# EAGLE board Precision Arduino Charlieplex 1.1 (EAGLE 6.2), part 1 of 2
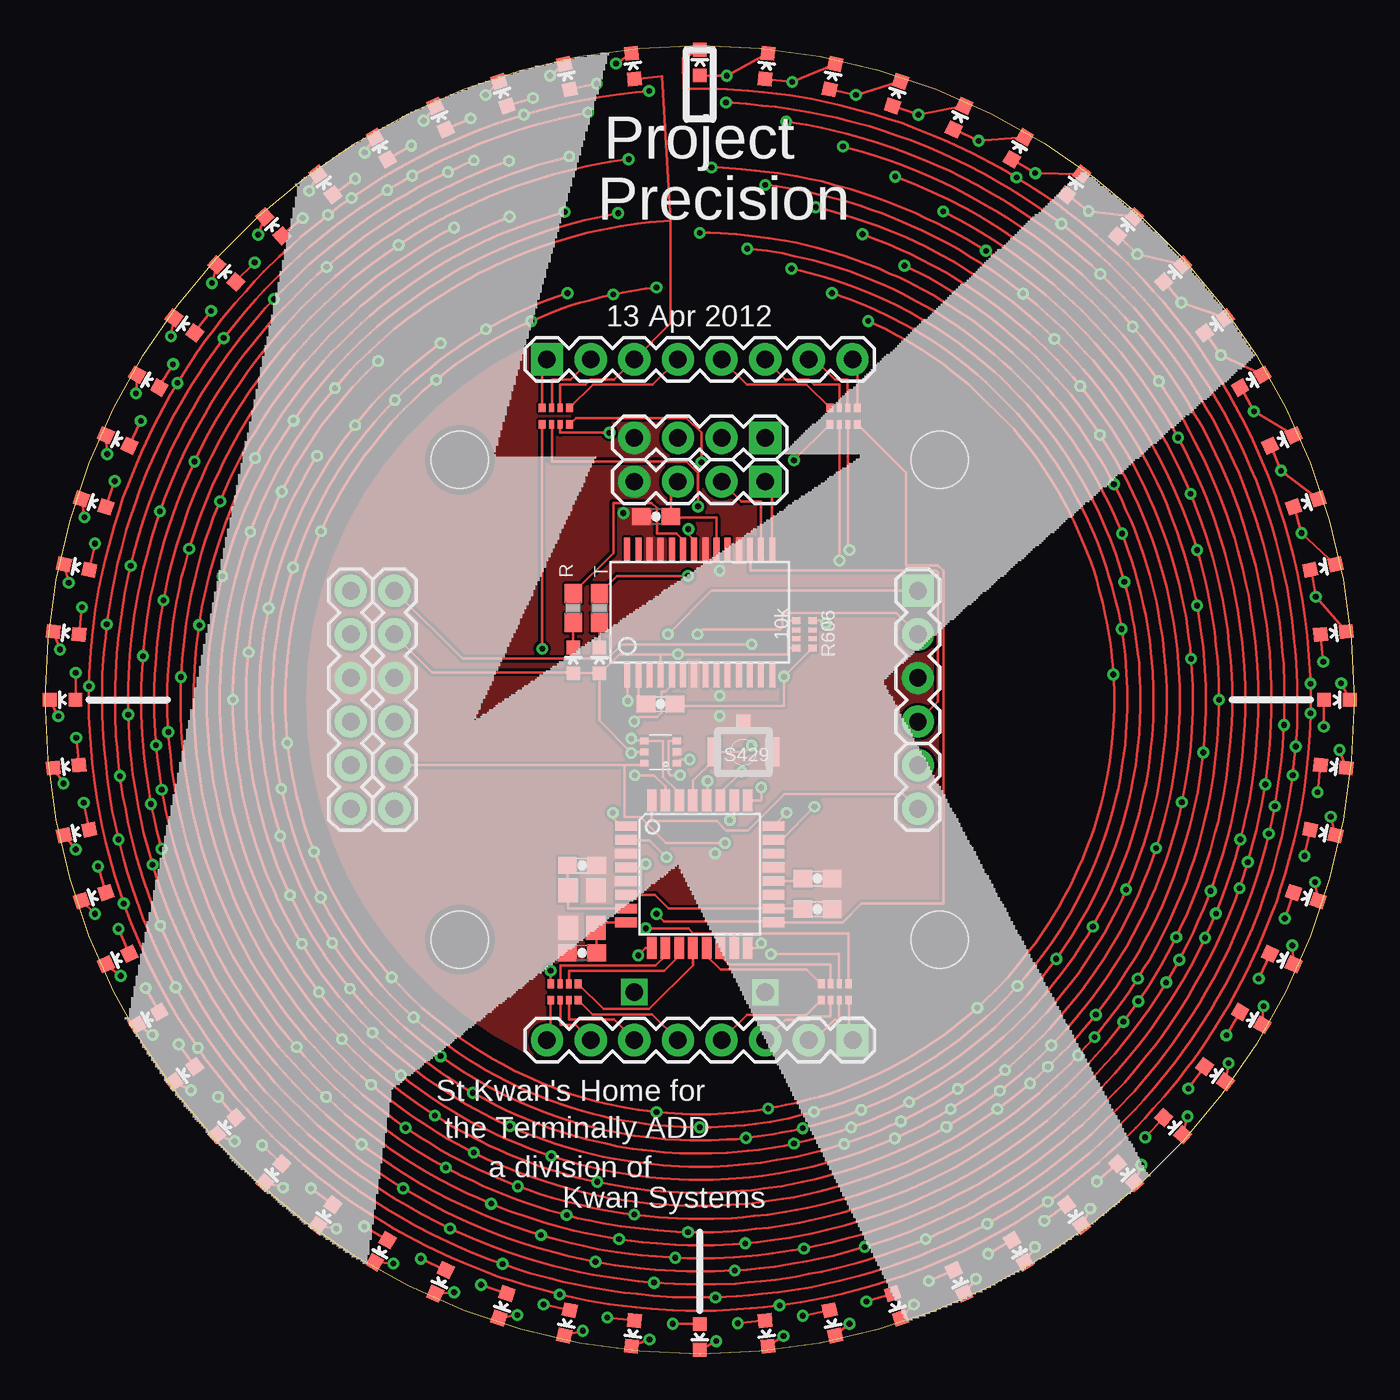
[diagram p2: board, top side]
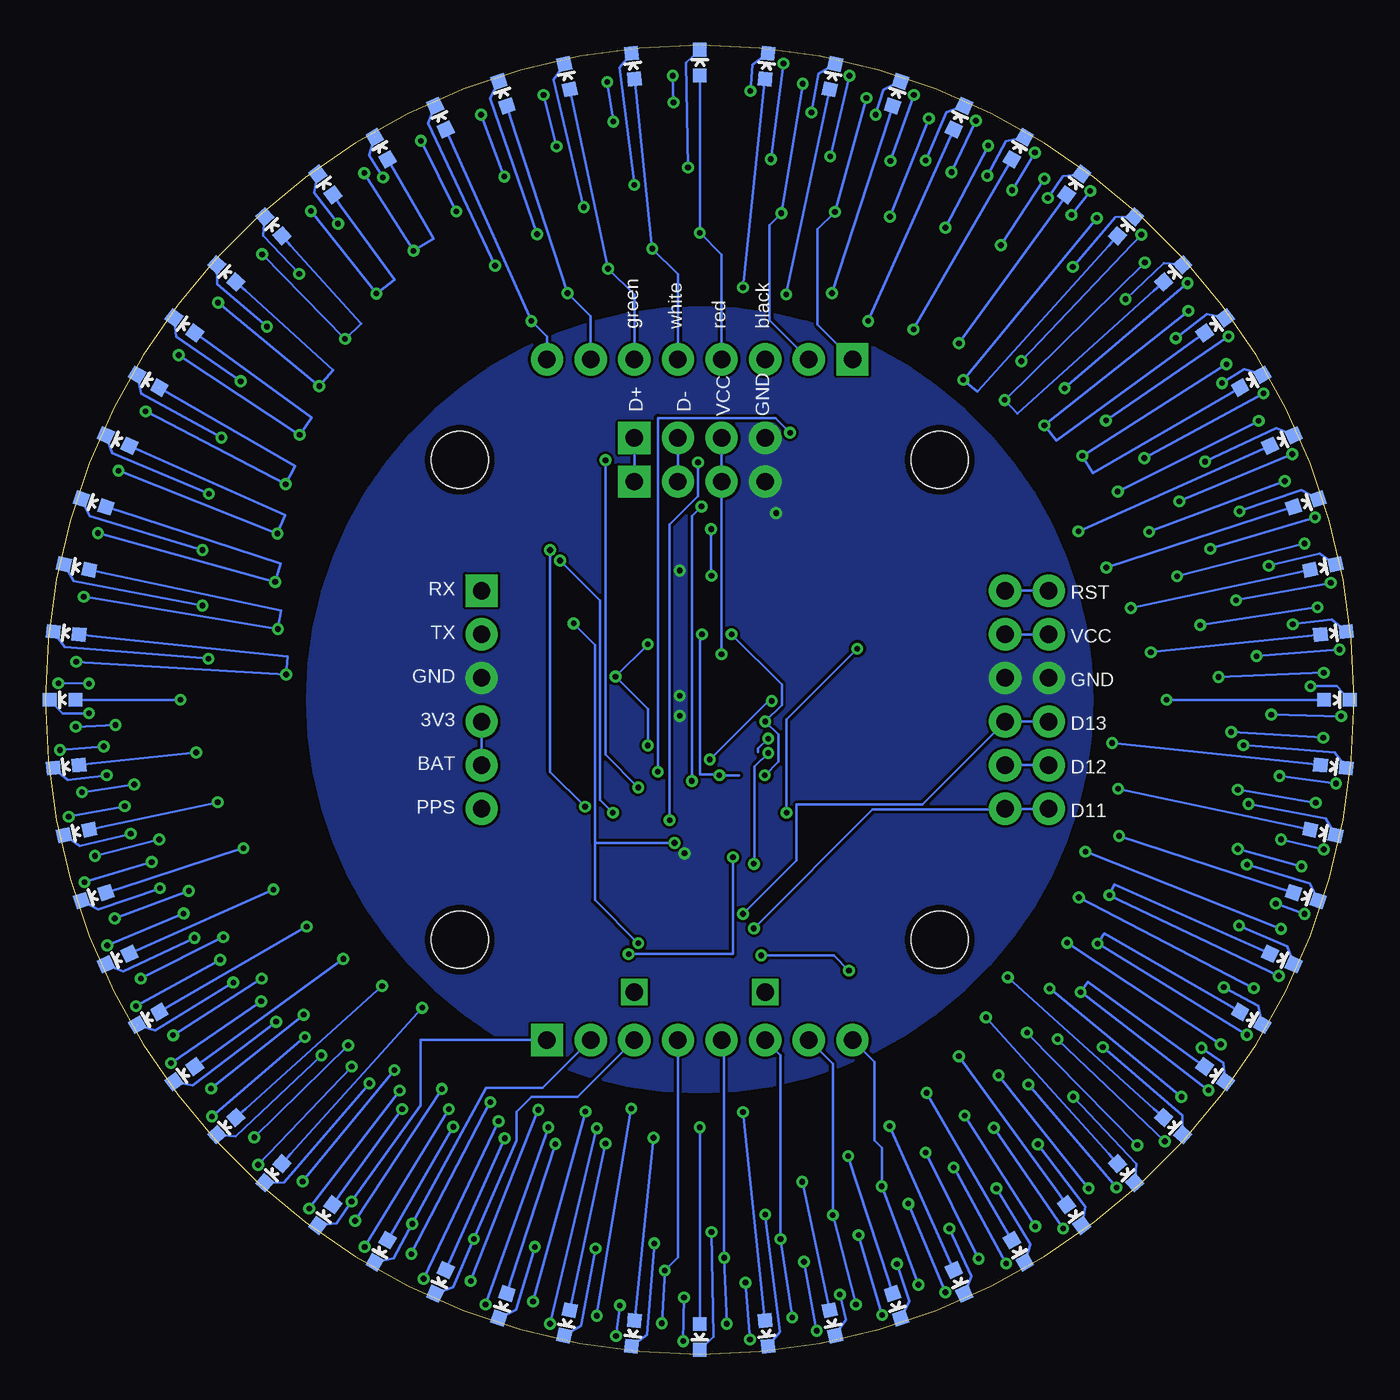
[diagram p3: board, bottom side, seen from below]

Size 76.2 x 76.2 mm. Coordinates in mm from the lower left corner, seen from the top.
Outline: 38.1,76.2 arc-90 76.2,38.1 arc-90 38.1,0 arc-90 0,38.1 arc-90 38.1,76.2
Copper layers (1*16): Top 0.0356mm / dielectric 1.5011mm / Bottom 0.0356mm
Design rules: minimum track width 6mil, minimum drill 13mil, track to track 6mil, track to pad 6mil, pad to pad 6mil, via to via 6mil, smd to smd 6mil, copper to edge 15mil, drill to drill 20mil, minimum pad ring 7mil, minimum via ring 7mil, stop-mask expansion 4mil, vias tented up to drill 14mil, thermal gap 10mil
Net classes: 0 default: width 0.152 mm, drill 0.33 mm, clearance 0.152 mm; 1 power: width 0.152 mm, drill 0.33 mm, clearance 0.152 mm

## Footprints (pad centres in the part's own frame; a part is rotated, then mirrored left to right if it is on the bottom)
0603-CAP = smd 1.1 x 1: 1 -0.85,0; 2 0.85,0
LED-0603 = smd 0.8 x 0.8: A 0,-0.75; C 0,0.75
1X04 = drill 1.016 pad 1.88 square: 1 0,0 | drill 1.016 pad 1.88: 2 2.54,0; 3 5.08,0; 4 7.62,0
1X06 = drill 1.016 pad 1.88: 1 0,0; 2 2.54,0; 3 5.08,0; 4 7.62,0; 5 10.16,0; 6 12.7,0
1X08 = drill 1.016 pad 1.88 square: 1 0,0 | drill 1.016 pad 1.88: 2 2.54,0; 3 5.08,0; 4 7.62,0; 5 10.16,0; 6 12.7,0; 7 15.24,0; 8 17.78,0
STAND-OFF = hole 3.302: 0,0
1X02 = drill 1.016 pad 1.88: 1 0,0; 2 2.54,0
CRA04 = smd 0.4 x 0.5: 1 -0.8,-0.475; 4 0.8,-0.475; 5 0.8,0.475; 8 -0.8,0.475 | smd 0.3 x 0.5: 2 -0.25,-0.475; 3 0.25,-0.475; 6 0.25,0.475; 7 -0.25,0.475
0603-RES = smd 1.1 x 1: 1 -0.85,0; 2 0.85,0
B3U-1100P = smd 0.8 x 1.7: P$1 -1.7,0; P$2 1.7,0 | smd 0.8 x 1.1: P$3 0,-1.65
TQFP32-08 = smd 1.27 x 0.559: 1 -4.293,2.8; 2 -4.293,2; 3 -4.293,1.2; 4 -4.293,0.4; 5 -4.293,-0.4; 6 -4.293,-1.2; 7 -4.293,-2; 8 -4.293,-2.8; 17 4.293,-2.8; 18 4.293,-2; 19 4.293,-1.2; 20 4.293,-0.4; 21 4.293,0.4; 22 4.293,1.2; 23 4.293,2; 24 4.293,2.8 | smd 0.559 x 1.27: 9 -2.8,-4.293; 10 -2,-4.293; 11 -1.2,-4.293; 12 -0.4,-4.293; 13 0.4,-4.293; 14 1.2,-4.293; 15 2,-4.293; 16 2.8,-4.293; 25 2.8,4.293; 26 2,4.293; 27 1.2,4.293; 28 0.4,4.293; 29 -0.4,4.293; 30 -1.2,4.293; 31 -2,4.293; 32 -2.8,4.293
SSOP28DB = smd 0.348 x 1.397: 1 -4.225,-3.656; 2 -3.575,-3.656; 3 -2.925,-3.656; 4 -2.275,-3.656; 5 -1.625,-3.656; 6 -0.975,-3.656; 7 -0.325,-3.656; 8 0.325,-3.656; 9 0.975,-3.656; 10 1.625,-3.656; 11 2.275,-3.656; 12 2.925,-3.656; 13 3.575,-3.656; 14 4.225,-3.656; 15 4.225,3.656; 16 3.575,3.656; 17 2.925,3.656; 18 2.275,3.656; 19 1.625,3.656; 20 0.975,3.656; 21 0.325,3.656; 22 -0.325,3.656; 23 -0.975,3.656; 24 -1.625,3.656; 25 -2.275,3.656; 26 -2.925,3.656; 27 -3.575,3.656; 28 -4.225,3.656
SC-70-6 = smd 0.4 x 0.5: 1 -0.65,-0.95; 2 0,-0.95; 3 0.65,-0.95; 4 0.65,0.95; 5 0,0.95; 6 -0.65,0.95
CRYSTAL_SMD = smd 1.4 x 1.15: 1 -1.092,-0.813; 2 1.092,-0.813; 3 1.092,0.813; 4 -1.092,0.813

## Placement (x,y rotation side)
C010  4.7uF  [0603-CAP]  35.56,48.77 180 top
C407  18pF  [0603-CAP]  31.24,28.45 180 top
C408  18pF  [0603-CAP]  31.24,23.37 0 top
C418  4.7uF  [0603-CAP]  44.96,25.91 180 top
C420  100nF  [0603-CAP]  44.96,27.69 0 top
C502  100nF  [0603-CAP]  35.81,37.85 180 top
D000  RED  [LED-0603]  38.1,75.18 0 top
D001  RED  [LED-0603]  41.99,74.98 354 top
D002  RED  [LED-0603]  45.82,74.37 348 top
D003  RED  [LED-0603]  49.56,73.38 342 top
D004  RED  [LED-0603]  53.19,71.98 336 top
D005  RED  [LED-0603]  56.64,70.21 330 top
D006  RED  [LED-0603]  59.89,68.1 324 top
D007  RED  [LED-0603]  62.92,65.66 318 top
D008  RED  [LED-0603]  65.66,62.92 312 top
D009  RED  [LED-0603]  68.1,59.89 306 top
D010  RED  [LED-0603]  70.21,56.64 300 top
D011  RED  [LED-0603]  71.98,53.19 294 top
D012  RED  [LED-0603]  73.38,49.56 288 top
D013  RED  [LED-0603]  74.37,45.82 282 top
D014  RED  [LED-0603]  74.98,41.99 276 top
D015  RED  [LED-0603]  75.18,38.1 270 top
D016  RED  [LED-0603]  74.98,34.21 264 top
D017  RED  [LED-0603]  74.37,30.38 258 top
D018  RED  [LED-0603]  73.38,26.64 252 top
D019  RED  [LED-0603]  71.98,23.01 246 top
D020  RED  [LED-0603]  70.21,19.56 240 top
D021  RED  [LED-0603]  68.1,16.31 234 top
D022  RED  [LED-0603]  65.66,13.28 228 top
D023  RED  [LED-0603]  62.92,10.54 222 top
D024  RED  [LED-0603]  59.89,8.1 216 top
D025  RED  [LED-0603]  56.64,5.99 210 top
D026  RED  [LED-0603]  53.19,4.22 204 top
D027  RED  [LED-0603]  49.56,2.82 198 top
D028  RED  [LED-0603]  45.82,1.83 192 top
D029  RED  [LED-0603]  41.99,1.22 186 top
D030  RED  [LED-0603]  38.1,1.02 180 top
D031  RED  [LED-0603]  34.21,1.22 174 top
D032  RED  [LED-0603]  30.38,1.83 168 top
D033  RED  [LED-0603]  26.64,2.82 162 top
D034  RED  [LED-0603]  23.01,4.22 156 top
D035  RED  [LED-0603]  19.56,5.99 150 top
D036  RED  [LED-0603]  16.31,8.1 144 top
D037  RED  [LED-0603]  13.28,10.54 138 top
D038  RED  [LED-0603]  10.54,13.28 132 top
D039  RED  [LED-0603]  8.1,16.31 126 top
D040  RED  [LED-0603]  5.99,19.56 120 top
D041  RED  [LED-0603]  4.22,23.01 114 top
D042  RED  [LED-0603]  2.82,26.64 108 top
D043  RED  [LED-0603]  1.83,30.38 102 top
D044  RED  [LED-0603]  1.22,34.21 96 top
D045  RED  [LED-0603]  1.02,38.1 90 top
D046  RED  [LED-0603]  1.22,41.99 84 top
D047  RED  [LED-0603]  1.83,45.82 78 top
D048  RED  [LED-0603]  2.82,49.56 72 top
D049  RED  [LED-0603]  4.22,53.19 66 top
D050  RED  [LED-0603]  5.99,56.64 60 top
D051  RED  [LED-0603]  8.1,59.89 54 top
D052  RED  [LED-0603]  10.54,62.92 48 top
D053  RED  [LED-0603]  13.28,65.66 42 top
D054  RED  [LED-0603]  16.31,68.1 36 top
D055  RED  [LED-0603]  19.56,70.21 30 top
D056  RED  [LED-0603]  23.01,71.98 24 top
D057  RED  [LED-0603]  26.64,73.38 18 top
D058  RED  [LED-0603]  30.38,74.37 12 top
D059  RED  [LED-0603]  34.21,74.98 6 top
D100  YELLOW  [LED-0603]  38.1,75.18 0 bottom
D101  YELLOW  [LED-0603]  41.99,74.98 6 bottom
D102  YELLOW  [LED-0603]  45.82,74.37 12 bottom
D103  YELLOW  [LED-0603]  49.56,73.38 18 bottom
D104  YELLOW  [LED-0603]  53.19,71.98 24 bottom
D105  YELLOW  [LED-0603]  56.64,70.21 30 bottom
D106  YELLOW  [LED-0603]  59.89,68.1 36 bottom
D107  YELLOW  [LED-0603]  62.92,65.66 42 bottom
D108  YELLOW  [LED-0603]  65.66,62.92 48 bottom
D109  YELLOW  [LED-0603]  68.1,59.89 54 bottom
D110  YELLOW  [LED-0603]  70.21,56.64 60 bottom
D111  YELLOW  [LED-0603]  71.98,53.19 66 bottom
D112  YELLOW  [LED-0603]  73.38,49.56 72 bottom
D113  YELLOW  [LED-0603]  74.37,45.82 78 bottom
D114  YELLOW  [LED-0603]  74.98,41.99 84 bottom
D115  YELLOW  [LED-0603]  75.18,38.1 90 bottom
D116  YELLOW  [LED-0603]  74.98,34.21 96 bottom
D117  YELLOW  [LED-0603]  74.37,30.38 102 bottom
D118  YELLOW  [LED-0603]  73.38,26.64 108 bottom
D119  YELLOW  [LED-0603]  71.98,23.01 114 bottom
D120  YELLOW  [LED-0603]  70.21,19.56 120 bottom
D121  YELLOW  [LED-0603]  68.1,16.31 126 bottom
D122  YELLOW  [LED-0603]  65.66,13.28 132 bottom
D123  YELLOW  [LED-0603]  62.92,10.54 138 bottom
D124  YELLOW  [LED-0603]  59.89,8.1 144 bottom
D125  YELLOW  [LED-0603]  56.64,5.99 150 bottom
D126  YELLOW  [LED-0603]  53.19,4.22 156 bottom
D127  YELLOW  [LED-0603]  49.56,2.82 162 bottom
D128  YELLOW  [LED-0603]  45.82,1.83 168 bottom
D129  YELLOW  [LED-0603]  41.99,1.22 174 bottom
D130  YELLOW  [LED-0603]  38.1,1.02 180 bottom
D131  YELLOW  [LED-0603]  34.21,1.22 186 bottom
D132  YELLOW  [LED-0603]  30.38,1.83 192 bottom
D133  YELLOW  [LED-0603]  26.64,2.82 198 bottom
D134  YELLOW  [LED-0603]  23.01,4.22 204 bottom
D135  YELLOW  [LED-0603]  19.56,5.99 210 bottom
D136  YELLOW  [LED-0603]  16.31,8.1 216 bottom
D137  YELLOW  [LED-0603]  13.28,10.54 222 bottom
D138  YELLOW  [LED-0603]  10.54,13.28 228 bottom
D139  YELLOW  [LED-0603]  8.1,16.31 234 bottom
D140  YELLOW  [LED-0603]  5.99,19.56 240 bottom
D141  YELLOW  [LED-0603]  4.22,23.01 246 bottom
D142  YELLOW  [LED-0603]  2.82,26.64 252 bottom
D143  YELLOW  [LED-0603]  1.83,30.38 258 bottom
D144  YELLOW  [LED-0603]  1.22,34.21 264 bottom
D145  YELLOW  [LED-0603]  1.02,38.1 270 bottom
D146  YELLOW  [LED-0603]  1.22,41.99 276 bottom
D147  YELLOW  [LED-0603]  1.83,45.82 282 bottom
D148  YELLOW  [LED-0603]  2.82,49.56 288 bottom
D149  YELLOW  [LED-0603]  4.22,53.19 294 bottom
D150  YELLOW  [LED-0603]  5.99,56.64 300 bottom
D151  YELLOW  [LED-0603]  8.1,59.89 306 bottom
D152  YELLOW  [LED-0603]  10.54,62.92 312 bottom
D153  YELLOW  [LED-0603]  13.28,65.66 318 bottom
D154  YELLOW  [LED-0603]  16.31,68.1 324 bottom
D155  YELLOW  [LED-0603]  19.56,70.21 330 bottom
D156  YELLOW  [LED-0603]  23.01,71.98 336 bottom
D157  YELLOW  [LED-0603]  26.64,73.38 342 bottom
D158  YELLOW  [LED-0603]  30.38,74.37 348 bottom
D159  YELLOW  [LED-0603]  34.21,74.98 354 bottom
D200  GREEN  [LED-0603]  -5.08,0 0 top  (outside the outline)
D201  GREEN  [LED-0603]  -10.16,0 0 top  (outside the outline)
D202  GREEN  [LED-0603]  -15.24,0 0 top  (outside the outline)
D203  GREEN  [LED-0603]  -20.32,0 0 top  (outside the outline)
D204  GREEN  [LED-0603]  -25.4,0 0 top  (outside the outline)
D205  GREEN  [LED-0603]  -30.48,0 0 top  (outside the outline)
D206  GREEN  [LED-0603]  -35.56,0 0 top  (outside the outline)
D207  GREEN  [LED-0603]  -40.64,0 0 top  (outside the outline)
D208  GREEN  [LED-0603]  -45.72,0 0 top  (outside the outline)
D209  GREEN  [LED-0603]  -50.8,0 0 top  (outside the outline)
D210  GREEN  [LED-0603]  -55.88,0 0 top  (outside the outline)
D211  GREEN  [LED-0603]  -60.96,0 0 top  (outside the outline)
D212  GREEN  [LED-0603]  -66.04,0 0 top  (outside the outline)
D213  GREEN  [LED-0603]  -71.12,0 0 top  (outside the outline)
D214  GREEN  [LED-0603]  -76.2,0 0 top  (outside the outline)
D215  GREEN  [LED-0603]  -81.28,0 0 top  (outside the outline)
D216  GREEN  [LED-0603]  -86.36,0 0 top  (outside the outline)
D217  GREEN  [LED-0603]  -91.44,0 0 top  (outside the outline)
D218  GREEN  [LED-0603]  -96.52,0 0 top  (outside the outline)
D219  GREEN  [LED-0603]  -101.6,0 0 top  (outside the outline)
D220  GREEN  [LED-0603]  -106.68,0 0 top  (outside the outline)
D221  GREEN  [LED-0603]  -111.76,0 0 top  (outside the outline)
D222  GREEN  [LED-0603]  -116.84,0 0 top  (outside the outline)
D223  GREEN  [LED-0603]  -121.92,0 0 top  (outside the outline)
D224  GREEN  [LED-0603]  -127,0 0 top  (outside the outline)
D225  GREEN  [LED-0603]  -132.08,0 0 top  (outside the outline)
D226  GREEN  [LED-0603]  -137.16,0 0 top  (outside the outline)
D227  GREEN  [LED-0603]  -142.24,0 0 top  (outside the outline)
D228  GREEN  [LED-0603]  -147.32,0 0 top  (outside the outline)
D229  GREEN  [LED-0603]  -152.4,0 0 top  (outside the outline)
D230  GREEN  [LED-0603]  -157.48,0 0 top  (outside the outline)
D231  GREEN  [LED-0603]  -162.56,0 0 top  (outside the outline)
D232  GREEN  [LED-0603]  -167.64,0 0 top  (outside the outline)
D233  GREEN  [LED-0603]  -172.72,0 0 top  (outside the outline)
D234  GREEN  [LED-0603]  -177.8,0 0 top  (outside the outline)
D235  GREEN  [LED-0603]  -182.88,0 0 top  (outside the outline)
D236  GREEN  [LED-0603]  -187.96,0 0 top  (outside the outline)
D237  GREEN  [LED-0603]  -193.04,0 0 top  (outside the outline)
D238  GREEN  [LED-0603]  -198.12,0 0 top  (outside the outline)
D239  GREEN  [LED-0603]  -203.2,0 0 top  (outside the outline)
D240  GREEN  [LED-0603]  -208.28,0 0 top  (outside the outline)
D241  GREEN  [LED-0603]  -213.36,0 0 top  (outside the outline)
D242  GREEN  [LED-0603]  -218.44,0 0 top  (outside the outline)
D243  GREEN  [LED-0603]  -223.52,0 0 top  (outside the outline)
D244  GREEN  [LED-0603]  -228.6,0 0 top  (outside the outline)
D245  GREEN  [LED-0603]  -233.68,0 0 top  (outside the outline)
D246  GREEN  [LED-0603]  -238.76,0 0 top  (outside the outline)
D247  GREEN  [LED-0603]  -243.84,0 0 top  (outside the outline)
D248  GREEN  [LED-0603]  -248.92,0 0 top  (outside the outline)
D249  GREEN  [LED-0603]  -254,0 0 top  (outside the outline)
D250  GREEN  [LED-0603]  -259.08,0 0 top  (outside the outline)
D251  GREEN  [LED-0603]  -264.16,0 0 top  (outside the outline)
D252  GREEN  [LED-0603]  -269.24,0 0 top  (outside the outline)
D253  GREEN  [LED-0603]  -274.32,0 0 top  (outside the outline)
D254  GREEN  [LED-0603]  -279.4,0 0 top  (outside the outline)
D255  GREEN  [LED-0603]  -284.48,0 0 top  (outside the outline)
D256  GREEN  [LED-0603]  -289.56,0 0 top  (outside the outline)
D257  GREEN  [LED-0603]  -294.64,0 0 top  (outside the outline)
D258  GREEN  [LED-0603]  -299.72,0 0 top  (outside the outline)
D259  GREEN  [LED-0603]  -304.8,0 0 top  (outside the outline)
D300  BLUE  [LED-0603]  -309.88,0 0 top  (outside the outline)
D301  BLUE  [LED-0603]  -314.96,0 0 top  (outside the outline)
D302  BLUE  [LED-0603]  -320.04,0 0 top  (outside the outline)
D303  BLUE  [LED-0603]  -325.12,0 0 top  (outside the outline)
D304  BLUE  [LED-0603]  -330.2,0 0 top  (outside the outline)
D305  BLUE  [LED-0603]  -335.28,0 0 top  (outside the outline)
D306  BLUE  [LED-0603]  -340.36,0 0 top  (outside the outline)
D307  BLUE  [LED-0603]  -345.44,0 0 top  (outside the outline)
D308  BLUE  [LED-0603]  -350.52,0 0 top  (outside the outline)
D309  BLUE  [LED-0603]  -355.6,0 0 top  (outside the outline)
D310  BLUE  [LED-0603]  -360.68,0 0 top  (outside the outline)
D311  BLUE  [LED-0603]  -365.76,0 0 top  (outside the outline)
D312  BLUE  [LED-0603]  -370.84,0 0 top  (outside the outline)
D313  BLUE  [LED-0603]  -375.92,0 0 top  (outside the outline)
D314  BLUE  [LED-0603]  -381,0 0 top  (outside the outline)
D315  BLUE  [LED-0603]  -386.08,0 0 top  (outside the outline)
D316  BLUE  [LED-0603]  -391.16,0 0 top  (outside the outline)
D317  BLUE  [LED-0603]  -396.24,0 0 top  (outside the outline)
D318  BLUE  [LED-0603]  -401.32,0 0 top  (outside the outline)
D319  BLUE  [LED-0603]  -406.4,0 0 top  (outside the outline)
D320  BLUE  [LED-0603]  -411.48,0 0 top  (outside the outline)
D321  BLUE  [LED-0603]  -416.56,0 0 top  (outside the outline)
D322  BLUE  [LED-0603]  -421.64,0 0 top  (outside the outline)
D323  BLUE  [LED-0603]  -426.72,0 0 top  (outside the outline)
D324  BLUE  [LED-0603]  -431.8,0 0 top  (outside the outline)
D325  BLUE  [LED-0603]  -436.88,0 0 top  (outside the outline)
D326  BLUE  [LED-0603]  -441.96,0 0 top  (outside the outline)
D327  BLUE  [LED-0603]  -447.04,0 0 top  (outside the outline)
D328  BLUE  [LED-0603]  -452.12,0 0 top  (outside the outline)
D329  BLUE  [LED-0603]  -457.2,0 0 top  (outside the outline)
D330  BLUE  [LED-0603]  -462.28,0 0 top  (outside the outline)
D331  BLUE  [LED-0603]  -467.36,0 0 top  (outside the outline)
D332  BLUE  [LED-0603]  -472.44,0 0 top  (outside the outline)
D333  BLUE  [LED-0603]  -477.52,0 0 top  (outside the outline)
D334  BLUE  [LED-0603]  -482.6,0 0 top  (outside the outline)
D335  BLUE  [LED-0603]  -487.68,0 0 top  (outside the outline)
D336  BLUE  [LED-0603]  -492.76,0 0 top  (outside the outline)
D337  BLUE  [LED-0603]  -497.84,0 0 top  (outside the outline)
D338  BLUE  [LED-0603]  -502.92,0 0 top  (outside the outline)
D339  BLUE  [LED-0603]  -508,0 0 top  (outside the outline)
D340  BLUE  [LED-0603]  -513.08,0 0 top  (outside the outline)
D341  BLUE  [LED-0603]  -518.16,0 0 top  (outside the outline)
D342  BLUE  [LED-0603]  -523.24,0 0 top  (outside the outline)
D343  BLUE  [LED-0603]  -528.32,0 0 top  (outside the outline)
D344  BLUE  [LED-0603]  -533.4,0 0 top  (outside the outline)
D345  BLUE  [LED-0603]  -538.48,0 0 top  (outside the outline)
D346  BLUE  [LED-0603]  -543.56,0 0 top  (outside the outline)
D347  BLUE  [LED-0603]  -548.64,0 0 top  (outside the outline)
D348  BLUE  [LED-0603]  -553.72,0 0 top  (outside the outline)
D349  BLUE  [LED-0603]  -558.8,0 0 top  (outside the outline)
D350  BLUE  [LED-0603]  -563.88,0 0 top  (outside the outline)
D351  BLUE  [LED-0603]  -568.96,0 0 top  (outside the outline)
D352  BLUE  [LED-0603]  -574.04,0 0 top  (outside the outline)
D353  BLUE  [LED-0603]  -579.12,0 0 top  (outside the outline)
D354  BLUE  [LED-0603]  -584.2,0 0 top  (outside the outline)
D355  BLUE  [LED-0603]  -589.28,0 0 top  (outside the outline)
D356  BLUE  [LED-0603]  -594.36,0 0 top  (outside the outline)
D357  BLUE  [LED-0603]  -599.44,0 0 top  (outside the outline)
D358  BLUE  [LED-0603]  -604.52,0 0 top  (outside the outline)
D359  BLUE  [LED-0603]  -609.6,0 0 top  (outside the outline)
D501  BLUE  [LED-0603]  30.73,40.39 0 top
D502  RED  [LED-0603]  32.26,40.39 0 top
J001  [1X04]  41.91,50.8 180 top
J002  [1X04]  41.91,53.34 180 top
J003  [1X06]  20.32,44.45 270 top
J004  [1X04]  50.8,44.45 270 top
J005  [1X06]  17.78,44.45 270 top
J405  [1X08]  29.21,57.91 0 top
J406  [1X08]  46.99,18.29 180 top
JP1  STAND-OFF  [STAND-OFF]  24.13,24.13 0 top
JP2  STAND-OFF  [STAND-OFF]  52.07,24.13 0 top
JP3  STAND-OFF  [STAND-OFF]  52.07,52.07 0 top
JP4  STAND-OFF  [STAND-OFF]  24.13,52.07 0 top
JP5  [1X02]  50.8,34.29 270 top
R1  47  [CRA04]  45.97,21.08 180 top
R2  47  [CRA04]  30.23,21.08 180 top
R3  47  [CRA04]  29.72,54.61 0 top
R4  47  [CRA04]  46.48,54.61 0 top
R501  680  [0603-RES]  30.73,43.43 270 top
R502  680  [0603-RES]  32.26,43.43 270 top
R606  10k  [CRA04]  44.2,41.91 270 top
S429  B3U-1100P  [B3U-1100P]  40.64,35.05 180 top
U401  ATMEGA328  [TQFP32-08]  38.1,27.94 0 top
U501  FT232RLSSOP  [SSOP28DB]  38.1,43.18 0 top
U602  ZF7  [SC-70-6]  35.81,35.05 90 top
Y401  16MHz  [CRYSTAL_SMD]  31.24,25.91 270 top

## Tracks (layer width: path | path; a pad name or v marks a point on that pad's centre or on a via)
3V3
  Top 0.152: U501.17 41.05,46.81 41.05,45.62 51.84,45.62 51.97,45.49 51.97,38 J004.4
  Bottom 0.152: JP5.1 J004.4
AREF
  Top 0.152: U401.20 44.11,27.54 C420.1
AT_RX  (via drill 0.33)
  Top 0.152: U401.30 36.88,32.23 36.88,32.69 35.97,33.6 35.97,35.69 34.87,35.69 U602.4 34.8,35.74 34.21,35.74 v34.11,35.84
  Bottom 0.152: 34.7,35.05 34.7,35.26 v34.11,35.84
AT_TX  (via drill 0.33)
  Top 0.152: v34.31,33.71 35.43,33.71 36.09,33.05 U401.31 | v34.29,36.83 34.57,37.11 35.61,37.11 35.87,37.36 35.87,38.58 36.09,38.58 36.47,38.96 U501.5 | v36.25,41.91 38.79,44.45 J004.1
  Bottom 0.152: v34.31,33.71 33.53,34.49 33.53,36.07 v34.29,36.83 33.33,37.8 33.33,38.99 v36.25,41.91
D12  (via drill 0.33)
  Top 0.152: J003.5 33.73,34.29 | 33.73,34.29 34.75,34.29 34.85,34.39 U602.6 | v41.68,23.93 41.4,23.65 U401.16 | 44.68,42.7 R606.8 45.44,42.71 v45.44,42.55 | v39.57,29.77 36.14,29.77 34.65,31.27 33.73,31.27 33.73,34.29
  Bottom 0.152: J005.5 J003.5 | v45.44,42.55 44.2,41.3 44.2,29.77 | 44.2,29.77 44.2,26.44 v41.68,23.93 | v39.57,29.77 44.2,29.77
GND  (via drill 0.33)
  other vias: 39.27,37.16 39.27,38.33 38.99,29.16 33.66,48.97 39.27,45.62
  pour Top (no thermals): 38.1,60.96 arc-90 60.96,38.1 arc-90 38.1,15.24 arc-90 15.24,38.1 arc-90
  pour Bottom (no thermals): 38.1,60.96 arc-90 60.96,38.1 arc-90 38.1,15.24 arc-90 15.24,38.1 arc-90
GPS_TX  (via drill 0.33)
  Top 0.152: U602.3 36.75,35.69 36.27,35.69 36.27,33.83 36.4,33.71 v36.96,33.71 | v37.97,41.91 38.25,42.19 42.77,42.19 42.93,42.34 42.93,43.16 49.55,43.16 J004.2
  Bottom 0.152: 35.81,33.71 v36.96,33.71 37.01,33.76 38.1,33.76 38.1,41.78 v37.97,41.91
N$3
  Top 0.152: C502.2 34.52,37.85 U501.2
N$5
  Top 0.152: R501.2 D501.C
N$6
  Top 0.152: R501.1 30.73,44.3 33.07,46.63 33.07,49.55 35.31,49.55 35.61,49.25 35.61,47.78 36.75,47.78 37.11,47.42 U501.23
N$7  (via drill 0.33)
  Top 0.152: v37.41,45.31 33.27,45.31 32.26,44.3 R502.1 | v37.44,48.03 37.44,47.73 37.77,47.4 U501.22
  Bottom 0.152: v37.41,45.31 37.44,45.34 v37.44,48.03
N$8
  Top 0.152: D502.C R502.2
N$106  (via drill 1.02)
  other vias: 34.29,21.08
N$907  (via drill 1.02)
  other vias: 41.91,21.08
P01  (via drill 0.33)
  Top 0.152: R1.1 46.76,24.51 40.13,24.51 40.1,24.51 | U401.15 40.1,24.51 | 40.1,24.51 37.72,24.51 37.44,24.79 v34.95,24.79
  Bottom 0.152: J005.6 J003.6 20.37,31.7 28.04,31.7 v34.95,24.79
P02  (via drill 0.33)
  Top 0.152: v42.24,23.29 46.2,23.29 46.2,21.57 R1.2 | v36.17,28.93 35.18,29.92 33.81,29.92 U401.2
  Bottom 0.152: v42.24,23.29 36.17,23.29 v36.17,28.93
P03
  Top 0.152: R1.3 45.72,22.71 39.8,22.71 39.32,23.19 39.32,23.65 U401.14
P04
  Top 0.152: R1.4 44.32,22.4 39.29,22.4 38.51,23.19 U401.13
P05
  Top 0.152: R2.1 31.04,21.54 32.49,20.09 35.15,20.09 37.69,22.63 U401.12
P06
  Top 0.152: R2.2 30.48,22.33 36.02,22.33 36.88,23.19 36.88,23.65 U401.11
P07
  Top 0.152: R2.3 30,21.57 30,22.63 35.53,22.63 36.09,23.19 U401.10
P08  (via drill 0.33)
  Top 0.152: v29.41,22.33 29.41,21.57 R2.4 | v34.52,23.22 34.95,23.65 U401.9
  Bottom 0.152: v29.41,22.33 30.3,23.22 v34.52,23.22
P09  (via drill 0.33)
  Top 0.152: v28.93,41.07 28.93,54.13 R3.1 | 33.81,30.76 U401.1 33.52,30.74 33.05,31.22 v33.05,31.52
  Bottom 0.152: v28.93,41.07 33.05,36.96 v33.05,31.52
P10  (via drill 0.33)
  Top 0.152: v38,49.35 38,51.31 37.34,51.97 29.49,51.97 29.49,54.13 R3.2 | v38.56,33.38 38.56,32.23 U401.28
  Bottom 0.152: v38,49.35 38.56,48.79 v38.56,33.38
P11  (via drill 0.33)
  Top 0.152: v32.84,53.65 29.97,53.65 R3.3 | v40.54,33.91 39.32,32.69 39.32,32.23 U401.27
  Bottom 0.152: v32.84,53.65 33.71,54.51 40.54,54.51 v40.54,33.91
P12  (via drill 0.33)
  Top 0.152: v38.2,51.92 38.2,53.65 37.34,54.51 30.89,54.51 30.53,54.15 R3.4 | U401.26 40.1,31.34 v39.85,31.09
  Bottom 0.152: v38.2,51.92 38.2,49.96 39.85,48.31 v39.85,31.09
P13  (via drill 0.33)
  Top 0.152: v43.59,52.05 45.67,54.13 R4.1 | U401.25 41.68,32.23 v41.68,32.99
  Bottom 0.152: v43.59,52.05 43.59,34.9 v41.68,32.99
P14  (via drill 0.33)
  Top 0.152: v46.23,46.2 R4.2 | v43.16,31.52 42.39,30.76 U401.24
  Bottom 0.152: v46.23,46.2 43.89,43.87 43.89,32.26 v43.16,31.52
P15  (via drill 0.33)
  Top 0.152: v46.81,46.81 46.74,46.81 R4.3 | v44.78,31.88 42.85,29.95 U401.23
  Bottom 0.152: v46.81,46.81 46.81,33.91 v44.78,31.88
P16  (via drill 0.33)
  Top 0.152: R4.4 47.3,54.13 50.09,51.33 50.09,45.92 51.97,45.92 52.27,45.62 52.27,26.24 47.52,26.24 46.43,25.15 U401.17 42.34,25.2 36.02,25.2 v35.59,25.63
  Bottom 0.152: J005.4 J003.4 25.15,32 32.46,32 32.46,28.75 v35.59,25.63
PPS
  Top 0.152: JP5.2 49.94,32.61 43.03,32.61 40.92,30.5 39.62,30.5 39.09,31.04 35.31,31.04 U401.32
Q01  (via drill 0.33)
  Top 0.152: v35.15,73.53 34.39,73.46 33.45,73.36 32.23,73.18 30.71,72.87 29.79,72.67 28.6,72.36 v27.86,72.16 27.1,71.91 26.24,71.63 25.07,71.2 23.65,70.59 22.78,70.21 21.69,69.65 20.32,68.89 19.53,68.43 18.47,67.74 v17.83,67.31 17.2,66.88 v16.46,66.32 15.47,65.53 14.88,65.05 14.3,64.52 13.61,63.91 12.72,63.02 12.19,62.46 11.68,61.9 11.05,61.19 10.26,60.25 9.8,59.61 9.32,59 8.79,58.24 8.1,57.2 v7.7,56.54 7.32,55.88 6.86,55.07 6.27,53.98 5.61,52.55 5.26,51.71 4.8,50.55 4.52,49.84 4.29,49.1 4.01,48.21 3.68,47.02 3.48,46.25 3.33,45.49 3.12,44.58 2.92,43.36 2.82,42.6 2.74,41.81 2.64,40.89 2.56,39.65 v2.54,38.89 2.54,37.16 2.62,35.94 2.67,35.15 2.74,34.39 2.85,33.45 3.02,32.23 3.33,30.71 3.53,29.79 3.83,28.6 4.04,27.86 4.29,27.1 v4.57,26.24 5,25.07 5.61,23.65 5.99,22.78 6.55,21.69 7.32,20.32 7.77,19.53 8.46,18.47 v8.89,17.83 9.32,17.2 9.88,16.46 10.67,15.47 11.15,14.88 11.68,14.3 12.29,13.61 13.18,12.72 13.74,12.19 14.3,11.68 15.01,11.05 15.95,10.26 16.59,9.8 17.2,9.32 17.96,8.79 19,8.1 19.66,7.7 20.32,7.32 21.13,6.86 22.23,6.27 23.65,5.61 24.49,5.26 25.65,4.8 26.36,4.52 27.1,4.29 27.99,4.01 29.18,3.68 v29.95,3.48 30.71,3.33 31.62,3.12 32.84,2.92 33.6,2.82 34.39,2.74 35.31,2.64 36.55,2.56 37.31,2.54 39.04,2.54 40.26,2.62 41.05,2.67 41.81,2.74 v42.75,2.85 43.97,3.02 45.49,3.33 46.41,3.53 47.6,3.83 48.34,4.04 49.1,4.29 49.96,4.57 51.13,5 52.55,5.61 53.42,5.99 54.51,6.55 55.88,7.32 56.67,7.77 57.73,8.46 v58.37,8.89 59,9.32 59.74,9.88 60.73,10.67 61.32,11.15 61.9,11.68 62.59,12.29 63.48,13.18 64.01,13.74 64.52,14.3 65.15,15.01 65.94,15.95 66.4,16.59 66.88,17.2 67.41,17.96 68.1,19 68.5,19.66 68.89,20.32 69.34,21.13 69.93,22.23 70.59,23.65 70.94,24.49 71.4,25.65 71.68,26.36 71.91,27.1 72.19,27.99 72.52,29.18 72.72,29.95 72.87,30.71 73.08,31.62 73.28,32.84 73.38,33.6 73.46,34.39 73.56,35.31 73.64,36.55 v73.66,37.31 v73.66,39.04 73.58,40.26 73.53,41.05 73.46,41.81 73.36,42.75 73.18,43.97 72.87,45.49 72.67,46.41 72.36,47.6 72.16,48.34 71.91,49.1 71.63,49.96 71.2,51.13 70.59,52.55 70.21,53.42 69.65,54.51 68.89,55.88 68.43,56.67 67.74,57.73 66.88,59 66.32,59.74 65.53,60.73 65.05,61.32 64.52,61.9 63.91,62.59 63.02,63.48 62.46,64.01 61.9,64.52 61.19,65.15 60.25,65.94 59.61,66.4 59,66.88 58.24,67.41 57.2,68.1 v56.54,68.5 55.88,68.89 55.07,69.34 53.98,69.93 52.55,70.59 51.71,70.94 50.55,71.4 49.84,71.68 49.1,71.91 48.21,72.19 47.02,72.52 46.25,72.72 45.49,72.87 44.58,73.08 43.36,73.28 42.6,73.38 41.81,73.46 40.89,73.56 39.65,73.64 38.89,73.66 37.16,73.66 37.13,75.44 D000.C
  Top 0.152: v42.98,1.07 D029.C | v2.9,25.63 D042.C | v15.37,67.72 15.89,68.66 D154.C | v75.44,39.06 D115.C | J406.1 46.79,18.29 46.79,20.6 R1.8 | D154.C
  Bottom 0.152: v73.66,39.04 v75.44,39.06 | v42.75,2.85 v42.98,1.07 | v4.57,26.24 v2.9,25.63 | v16.46,66.32 v15.37,67.72 | v56.54,68.5 57.35,69.8 D105.C | v73.66,37.31 75.18,37.29 D115.C | v29.95,3.48 29.59,2.01 D132.C | v8.89,17.83 7.62,16.97 D139.C | v2.54,38.89 1.02,38.91 D145.C | v7.7,56.54 6.4,57.35 D150.C | v17.83,67.31 16.97,68.58 D154.C | v27.86,72.16 27.41,73.61 D157.C | v35.15,73.53 35.03,75.06 D159.C | D124.C 59.23,7.62 v58.37,8.89 54.36,14.48 54.36,18.29 J406.1
Q02  (via drill 0.33)  (1 unrouted)
  Top 0.152: v39.62,72.87 40.82,72.8 41.73,72.69 42.49,72.62 43.23,72.52 44.45,72.31 45.34,72.14 46.08,71.98 46.81,71.78 47.98,71.48 48.84,71.2 49.58,70.94 50.29,70.69 51.41,70.26 52.25,69.9 53.62,69.24 54.71,68.68 55.5,68.22 56.16,67.84 56.79,67.44 57.81,66.78 58.55,66.24 v59.16,65.81 59.77,65.33 60.71,64.57 61.39,63.96 61.95,63.45 63.35,62.05 63.96,61.39 64.47,60.81 64.95,60.22 65.71,59.28 66.24,58.55 66.7,57.94 67.11,57.3 67.77,56.29 68.22,55.5 68.61,54.84 68.96,54.18 69.52,53.09 69.9,52.25 70.18,51.56 70.48,50.85 70.89,49.71 71.2,48.84 71.42,48.13 71.63,47.4 71.93,46.23 72.14,45.34 72.29,44.6 72.42,43.84 72.59,42.65 72.69,41.73 72.77,40.97 72.82,40.23 72.9,39.01 72.9,37.34 72.87,36.58 v72.8,35.38 72.69,34.47 v72.62,33.71 72.52,32.97 72.31,31.75 72.14,30.86 71.98,30.12 71.78,29.39 71.48,28.22 71.2,27.36 70.94,26.62 70.69,25.91 70.26,24.79 69.9,23.95 69.24,22.58 68.68,21.49 68.22,20.7 67.84,20.04 67.44,19.41 66.78,18.39 66.24,17.65 65.81,17.04 65.33,16.43 64.57,15.49 63.96,14.81 63.45,14.25 62.05,12.85 61.39,12.24 60.81,11.73 60.22,11.25 59.28,10.49 58.55,9.96 57.94,9.5 57.3,9.09 56.29,8.43 55.5,7.98 v54.84,7.59 54.18,7.24 53.09,6.68 52.25,6.3 51.56,6.02 50.85,5.71 49.71,5.31 48.84,5 48.13,4.78 47.4,4.57 46.23,4.27 45.34,4.06 44.6,3.91 43.84,3.79 42.65,3.61 41.73,3.5 40.97,3.43 40.23,3.38 v39.01,3.3 37.34,3.3 36.58,3.33 35.38,3.4 34.47,3.5 33.71,3.58 32.97,3.68 31.75,3.89 30.86,4.06 30.12,4.22 29.39,4.42 28.22,4.72 27.36,5 v26.62,5.26 25.91,5.51 24.79,5.94 23.95,6.3 22.58,6.96 21.49,7.52 20.7,7.98 20.04,8.36 19.41,8.76 18.39,9.42 17.65,9.96 17.04,10.39 16.43,10.87 15.49,11.63 14.81,12.24 14.25,12.75 12.85,14.15 12.24,14.81 11.73,15.39 11.25,15.98 10.49,16.92 9.96,17.65 9.5,18.26 9.09,18.9 8.43,19.91 7.98,20.7 v7.59,21.36 7.24,22.02 6.68,23.11 6.3,23.95 6.02,24.64 5.71,25.35 5.31,26.49 5,27.36 4.78,28.07 4.57,28.8 v4.27,29.97 4.06,30.86 3.91,31.6 3.79,32.36 3.61,33.55 3.5,34.47 3.43,35.23 3.38,35.97 3.3,37.19 3.3,38.86 3.33,39.62 3.4,40.82 3.5,41.73 v3.58,42.49 3.68,43.23 3.89,44.45 4.06,45.34 4.22,46.08 4.42,46.81 4.72,47.98 5,48.84 5.26,49.58 5.51,50.29 5.94,51.41 6.3,52.25 6.96,53.62 7.52,54.71 7.98,55.5 8.36,56.16 8.76,56.79 9.42,57.81 9.96,58.55 v10.39,59.16 10.87,59.77 11.63,60.71 12.24,61.39 12.75,61.95 14.15,63.35 14.81,63.96 15.39,64.47 15.98,64.95 16.92,65.71 17.65,66.24 18.26,66.7 18.9,67.11 v19.91,67.77 20.7,68.22 v21.36,68.61 22.02,68.96 23.11,69.52 23.95,69.9 24.64,70.18 25.35,70.48 26.49,70.89 27.36,71.2 28.07,71.42 28.8,71.63 29.97,71.93 30.86,72.14 v31.6,72.29
  Top 0.152: D000.A v39.67,74.42 D001.C | v39.06,0.76 D030.C | v1.78,29.39 D043.C | v18.59,69.95 D055.C | v75.34,35.18 D016.C | J406.2 44.78,18.29 45.95,19.46 46.2,19.46 46.2,20.6 R1.7 | D016.C | D055.C
  Bottom 0.152: v39.62,72.87 v39.67,74.42 | v72.8,35.38 v75.34,35.18 | v39.01,3.3 v39.06,0.76 | v4.27,29.97 v1.78,29.39 | v19.91,67.77 v18.59,69.95 | v59.16,65.81 60.55,67.61 D106.C | v72.62,33.71 74.91,33.43 D016.C 75.68,34.14 | v26.62,5.26 25.88,3.07 D133.C | v7.59,21.36 5.59,20.27 D140.C | v3.58,42.49 1.29,42.77 D146.C | v10.39,59.16 8.59,60.55 D151.C | v21.36,68.61 20.27,70.61 D055.C | v31.6,72.29 31.19,74.55 D158.C | D125.C 55.93,5.59 v54.84,7.59 50.55,15.49 47.24,15.49 J406.2
Q03  (via drill 0.33)
  Top 0.152: v43.13,71.75 44.3,71.58 45.19,71.4 45.9,71.22 46.63,71.04 47.78,70.74 48.62,70.46 49.33,70.23 50.01,69.98 51.13,69.55 51.94,69.19 52.63,68.89 53.29,68.56 54.33,68.02 55.12,67.56 55.75,67.21 56.39,66.8 57.38,66.14 58.12,65.63 58.7,65.2 59.28,64.75 60.2,63.98 60.88,63.4 v61.42,62.89 61.95,62.38 62.79,61.52 63.4,60.88 63.88,60.33 64.36,59.74 65.1,58.83 65.63,58.12 66.06,57.51 66.47,56.9 67.13,55.88 67.56,55.12 67.94,54.48 68.3,53.82 68.81,52.76 69.19,51.94 69.49,51.26 69.77,50.57 70.18,49.45 70.46,48.62 70.69,47.9 70.89,47.19 71.2,46.05 71.4,45.19 71.53,44.45 71.68,43.71 71.86,42.55 71.96,41.66 72.01,40.92 72.08,40.18 72.14,38.99 72.14,37.36 v72.11,36.63 72.03,35.43 71.96,34.54 71.75,33.07 v71.58,31.9 71.4,31.01 v71.22,30.3 71.04,29.57 70.74,28.42 70.46,27.58 70.23,26.87 69.98,26.19 69.55,25.07 69.19,24.26 68.89,23.57 68.56,22.91 68.02,21.87 67.56,21.08 67.21,20.45 66.8,19.81 66.14,18.82 65.63,18.09 65.2,17.5 64.75,16.92 63.98,16 63.4,15.32 62.38,14.25 61.52,13.41 60.88,12.8 60.33,12.32 59.74,11.84 58.83,11.1 58.12,10.57 57.51,10.13 56.9,9.73 55.88,9.07 55.12,8.64 54.48,8.26 53.82,7.9 52.76,7.39 51.94,7.01 v51.26,6.71 50.57,6.43 49.45,6.02 48.62,5.74 47.9,5.51 47.19,5.31 46.05,5 45.19,4.8 44.45,4.67 43.71,4.52 42.55,4.34 41.66,4.24 40.92,4.19 40.18,4.12 38.99,4.06 37.36,4.06 36.63,4.09 v35.43,4.17 34.54,4.24 33.07,4.45 31.9,4.62 31.01,4.8 30.3,4.98 29.57,5.16 28.42,5.46 27.58,5.74 26.87,5.97 26.19,6.22 25.07,6.66 24.26,7.01 v23.57,7.32 22.91,7.64 21.87,8.18 21.08,8.64 20.45,8.99 19.81,9.4 18.82,10.06 18.09,10.57 17.5,11 16.92,11.46 16,12.22 15.32,12.8 14.25,13.82 13.41,14.68 12.8,15.32 12.32,15.88 11.84,16.46 11.1,17.37 10.57,18.09 10.13,18.69 9.73,19.3 9.07,20.32 8.64,21.08 8.26,21.72 7.9,22.38 7.39,23.44 7.01,24.26 v6.71,24.94 6.43,25.63 6.02,26.75 5.74,27.58 5.51,28.3 5.31,29.01 5,30.15 4.8,31.01 4.67,31.75 4.52,32.49 v4.34,33.66 4.24,34.54 4.19,35.28 4.12,36.02 4.06,37.21 4.06,38.84 4.09,39.57 4.17,40.77 4.24,41.66 4.45,43.13 4.62,44.3 4.8,45.19 v4.98,45.9 5.16,46.63 5.46,47.78 5.74,48.62 5.97,49.33 6.22,50.01 6.66,51.13 7.01,51.94 7.32,52.63 7.64,53.29 8.18,54.33 8.64,55.12 8.99,55.75 9.4,56.39 10.06,57.38 10.57,58.12 11,58.7 11.46,59.28 12.22,60.2 12.8,60.88 v13.31,61.42 13.82,61.95 14.68,62.79 15.32,63.4 15.88,63.88 16.46,64.36 17.37,65.1 18.09,65.63 18.69,66.06 19.3,66.47 20.32,67.13 21.08,67.56 21.72,67.94 22.38,68.3 v23.44,68.81 24.26,69.19 v24.94,69.49
  Top 0.152: D001.A v43.48,74.07 D002.C | v74.42,36.52 D015.A | v35.18,0.86 D031.C | v1.07,33.22 D044.C | v22.02,71.81 22.73,72.62 D056.C | v74.83,31.29 D017.C | J406.3 43.08,19.46 44.45,19.46 44.65,19.66 45.72,19.66 R1.6 | D017.C | D056.C
  Bottom 0.152: v43.13,71.75 v43.48,74.07 | v72.11,36.63 v74.42,36.52 | v71.58,31.9 v74.83,31.29 | v35.43,4.17 v35.18,0.86 | v4.34,33.66 v1.07,33.22 | v23.44,68.81 v22.02,71.81 | v61.42,62.89 63.52,65.13 D107.C | v71.22,30.3 74.19,29.59 D017.C | v23.57,7.32 22.28,4.55 D134.C | v6.71,24.94 3.89,23.75 D141.C | v4.98,45.9 2.01,46.61 D147.C | v13.31,61.42 11.07,63.52 D152.C | v24.94,69.49 23.75,72.31 D056.C | D126.C 52.45,3.89 v51.26,6.71 48.77,12.45 48.77,14.1 47.88,14.99 45.21,14.99 J406.3
Q04  (via drill 0.33)
  Top 0.152: v46.43,70.31 47.55,70 48.39,69.75 49.07,69.52 49.76,69.27 50.83,68.83 51.64,68.5 52.3,68.2 52.96,67.87 53.98,67.33 54.74,66.9 55.37,66.55 55.98,66.17 56.95,65.53 57.66,65.02 58.24,64.59 58.8,64.14 59.72,63.4 60.38,62.84 60.91,62.33 62.23,61.01 62.84,60.38 v63.3,59.82 63.78,59.26 65.02,57.66 65.43,57.07 65.84,56.46 66.47,55.47 66.9,54.74 67.28,54.1 67.61,53.47 68.12,52.43 68.5,51.64 68.78,50.98 69.06,50.29 69.47,49.2 69.75,48.39 69.95,47.7 70.16,46.99 70.46,45.87 70.64,45.01 70.79,44.3 70.92,43.59 71.09,42.44 71.2,41.58 71.27,40.84 71.32,40.13 71.37,38.96 71.37,37.36 71.35,36.65 71.27,35.48 71.2,34.62 71.12,33.91 v71.02,33.17 70.81,32.03 70.64,31.19 70.48,30.48 70.31,29.77 v70,28.65 69.75,27.81 v69.52,27.13 69.27,26.44 68.83,25.38 68.5,24.56 68.2,23.9 67.87,23.24 67.33,22.23 66.9,21.46 66.55,20.83 66.17,20.22 65.53,19.25 65.02,18.54 64.59,17.96 64.14,17.4 63.4,16.48 62.84,15.82 62.33,15.29 61.01,13.97 60.38,13.36 59.82,12.9 59.26,12.42 57.66,11.18 57.07,10.77 56.46,10.36 55.47,9.73 54.74,9.3 54.1,8.91 53.47,8.59 52.43,8.08 51.64,7.7 50.98,7.42 50.29,7.14 49.2,6.73 48.39,6.45 v47.7,6.25 46.99,6.04 45.87,5.74 45.01,5.56 44.3,5.41 43.59,5.28 42.44,5.11 41.58,5 40.84,4.93 v40.13,4.88 38.96,4.83 37.36,4.83 36.65,4.85 35.48,4.93 34.62,5 33.91,5.08 33.17,5.18 v32.03,5.38 31.19,5.56 30.48,5.71 29.77,5.89 28.65,6.2 27.81,6.45 27.13,6.68 26.44,6.93 25.38,7.37 24.56,7.7 23.9,8 23.24,8.33 22.23,8.87 21.46,9.3 v20.83,9.65 20.22,10.03 19.25,10.67 18.54,11.18 17.96,11.61 17.4,12.06 16.48,12.8 15.82,13.36 15.29,13.87 13.97,15.19 13.36,15.82 12.9,16.38 12.42,16.94 11.18,18.54 10.77,19.13 10.36,19.74 9.73,20.73 9.3,21.46 8.91,22.1 8.59,22.73 8.08,23.77 7.7,24.56 7.42,25.22 7.14,25.91 6.73,27 6.45,27.81 v6.25,28.5 6.04,29.21 5.74,30.33 5.56,31.19 5.41,31.9 5.28,32.61 5.11,33.76 5,34.62 4.93,35.36 4.88,36.07 v4.83,37.24 4.83,38.84 4.85,39.55 4.93,40.72 5,41.58 5.08,42.29 5.18,43.03 5.38,44.17 5.56,45.01 5.71,45.72 5.89,46.43 6.2,47.55 6.45,48.39 v6.68,49.07 6.93,49.76 7.37,50.83 7.7,51.64 8,52.3 8.33,52.96 8.87,53.98 9.3,54.74 9.65,55.37 10.03,55.98 10.67,56.95 11.18,57.66 11.61,58.24 12.06,58.8 12.8,59.72 13.36,60.38 13.87,60.91 15.19,62.23 15.82,62.84 v16.38,63.3 16.94,63.78 18.54,65.02 19.13,65.43 19.74,65.84 20.73,66.47 21.46,66.9 22.1,67.28 22.73,67.61 23.77,68.12 24.56,68.5 25.22,68.78 25.91,69.06 v27,69.47
  Top 0.152: v40.31,1.8 D029.A | v31.29,1.37 D032.C | v0.76,37.13 D045.C | v25.63,73.3 D057.C | D002.A v47.19,73.3 D003.C | v74.07,32.72 D016.A | v73.91,27.48 D018.C | J406.4 40.84,19.76 44.32,19.76 R1.5 | D018.C
  Bottom 0.152: v46.43,70.31 v47.19,73.3 | v71.02,33.17 v74.07,32.72 | v70,28.65 v73.91,27.48 | v40.31,1.8 v40.13,4.88 39.37,5.64 J406.4 | v32.03,5.38 v31.29,1.37 | v4.83,37.24 v0.76,37.13 | v27,69.47 v25.63,73.3 | v63.3,59.82 66.19,62.31 D108.C | v69.52,27.13 73.13,25.88 D018.C | v47.7,6.25 48.79,2.59 D127.C | v20.83,9.65 18.85,6.4 D135.C | v6.25,28.5 2.59,27.41 D142.C | v6.68,49.07 3.07,50.32 D148.C | v16.38,63.3 13.89,66.19 D153.C
Q05  (via drill 0.33)
  Top 0.152: v49.48,68.56 50.55,68.15 51.33,67.79 51.97,67.51 52.6,67.21 53.62,66.67 54.36,66.27 54.97,65.89 55.58,65.53 56.52,64.9 57.2,64.41 57.78,63.98 58.34,63.55 59.21,62.81 59.84,62.26 60.38,61.77 60.88,61.29 61.67,60.48 62.26,59.84 62.74,59.33 63.2,58.78 63.88,57.89 64.41,57.2 v64.82,56.64 65.2,56.03 65.81,55.09 66.27,54.36 66.6,53.75 66.93,53.11 67.44,52.09 67.79,51.33 68.35,50.01 68.76,48.95 69.01,48.16 69.24,47.47 69.42,46.79 69.72,45.7 69.9,44.86 70.05,44.17 70.16,43.46 70.33,42.34 70.43,41.5 70.51,40.79 70.56,40.08 70.61,38.96 70.61,37.39 70.59,36.68 70.51,35.56 70.43,34.7 70.36,33.98 70.26,33.3 70.08,32.18 69.9,31.34 69.75,30.66 v69.57,29.97 69.27,28.85 69.01,28.04 68.56,26.72 v68.15,25.65 67.79,24.87 v67.51,24.23 67.21,23.6 66.67,22.58 66.27,21.84 65.89,21.23 65.53,20.62 64.9,19.68 64.41,19 63.98,18.41 63.55,17.86 62.81,16.99 62.26,16.36 61.77,15.82 61.29,15.32 60.48,14.53 59.84,13.95 59.33,13.46 58.78,13.01 57.89,12.32 57.2,11.79 56.64,11.38 56.03,11 55.09,10.39 54.36,9.93 53.75,9.6 53.11,9.27 52.09,8.76 51.33,8.41 50.01,7.85 48.95,7.44 48.16,7.19 47.47,6.96 46.79,6.78 45.7,6.48 44.86,6.3 v44.17,6.15 43.46,6.04 42.34,5.87 41.5,5.77 40.79,5.69 40.08,5.64 38.96,5.59 37.39,5.59 v36.68,5.61 35.56,5.69 34.7,5.77 33.98,5.84 33.3,5.94 32.18,6.12 31.34,6.3 30.66,6.45 29.97,6.63 v28.85,6.93 28.04,7.19 26.72,7.64 25.65,8.05 24.87,8.41 24.23,8.69 23.6,8.99 22.58,9.53 21.84,9.93 21.23,10.31 20.62,10.67 19.68,11.3 19,11.79 v18.41,12.22 17.86,12.65 16.99,13.39 16.36,13.95 15.82,14.43 15.32,14.91 14.53,15.72 13.95,16.36 13.46,16.87 13.01,17.42 12.32,18.31 11.79,19 11.38,19.56 11,20.17 10.39,21.11 9.93,21.84 9.6,22.45 9.27,23.09 8.76,24.11 8.41,24.87 7.85,26.19 7.44,27.25 7.19,28.04 6.96,28.73 v6.78,29.41 6.48,30.5 6.3,31.34 v6.15,32.03 6.04,32.74 5.87,33.86 5.77,34.7 5.69,35.41 5.64,36.12 5.59,37.24 5.59,38.81 5.61,39.52 v5.69,40.64 5.77,41.5 5.84,42.22 5.94,42.9 6.12,44.02 6.3,44.86 6.45,45.54 6.63,46.23 6.93,47.35 7.19,48.16 7.64,49.48 8.05,50.55 8.41,51.33 v8.69,51.97 8.99,52.6 9.53,53.62 9.93,54.36 10.31,54.97 10.67,55.58 11.3,56.52 11.79,57.2 12.22,57.78 12.65,58.34 13.39,59.21 13.95,59.84 14.43,60.38 14.91,60.88 15.72,61.67 16.36,62.26 16.87,62.74 17.42,63.2 18.31,63.88 19,64.41 19.56,64.82 20.17,65.2 21.11,65.81 21.84,66.27 22.45,66.6 23.09,66.93 24.11,67.44 24.87,67.79 26.19,68.35 27.25,68.76 28.04,69.01 28.73,69.24 29.41,69.42 v30.5,69.72
  Top 0.152: v29.39,74.42 D058.C | v36.52,1.78 D030.A | v27.48,2.29 D033.C | v3.07,28.4 D042.A | v0.86,41.02 D046.C | D003.A v50.83,72.16 D004.C | v73.3,29.01 D017.A | v72.59,23.8 D019.C | J406.5 35.33,19.79 31.85,19.79 R2.8 | D019.C
  Bottom 0.152: v49.48,68.56 v50.83,72.16 | v69.57,29.97 v73.3,29.01 | v68.15,25.65 v72.59,23.8 | v36.52,1.78 v36.68,5.61 36.68,18.14 J406.5 | v28.85,6.93 v27.48,2.29 | v6.78,29.41 v3.07,28.4 | v5.69,40.64 v0.86,41.02 | v30.5,69.72 v29.39,74.42 | v64.82,56.64 68.58,59.23 D109.C | v67.51,24.23 71.65,22.28 D019.C | v44.17,6.15 45.01,1.65 D128.C | v18.41,12.22 15.65,8.59 D136.C | v6.15,32.03 1.65,31.19 D143.C | v8.69,51.97 4.55,53.92 D149.C
Q06  (via drill 0.33)  (3 unrouted)
  Top 0.152: v52.27,66.52 53.24,66.02 53.98,65.61 54.56,65.25 55.17,64.87 56.08,64.26 56.77,63.78 57.33,63.37 57.86,62.94 58.73,62.26 59.33,61.7 59.84,61.21 60.35,60.76 61.14,59.94 61.7,59.33 62.15,58.83 62.61,58.29 63.3,57.43 63.78,56.77 64.19,56.19 64.57,55.63 65.18,54.69 65.61,53.98 v65.94,53.37 66.27,52.76 66.75,51.77 67.11,51 67.39,50.37 67.64,49.73 68.02,48.69 68.3,47.9 68.71,46.58 68.96,45.52 69.16,44.7 69.42,43.33 69.57,42.24 69.67,41.43 69.75,40.74 69.8,40.03 69.85,38.94 69.85,37.41 69.83,36.7 69.75,35.61 69.67,34.77 69.6,34.09 69.49,33.4 69.32,32.31 69.16,31.5 69.01,30.81 68.83,30.15 68.56,29.08 68.3,28.3 v67.84,26.98 67.44,25.96 67.11,25.2 66.83,24.56 66.52,23.93 v66.02,22.96 65.61,22.23 v65.25,21.64 64.87,21.03 64.26,20.12 63.78,19.43 63.37,18.87 62.94,18.34 62.26,17.48 61.7,16.87 61.21,16.36 60.76,15.85 59.94,15.06 59.33,14.5 58.83,14.05 58.29,13.59 57.43,12.9 56.77,12.42 56.19,12.01 55.63,11.63 54.69,11.02 53.98,10.59 52.76,9.93 51.77,9.45 51,9.09 50.37,8.81 49.73,8.56 48.69,8.18 47.9,7.9 46.58,7.49 45.52,7.24 44.7,7.04 43.33,6.78 42.24,6.63 41.43,6.53 v40.74,6.45 40.03,6.4 38.94,6.35 37.41,6.35 36.7,6.38 35.61,6.45 34.77,6.53 34.09,6.6 v33.4,6.71 32.31,6.88 31.5,7.04 30.81,7.19 30.15,7.37 29.08,7.64 28.3,7.9 26.98,8.36 v25.96,8.76 25.2,9.09 24.56,9.37 23.93,9.68 22.96,10.19 22.23,10.59 21.64,10.95 21.03,11.33 20.12,11.94 19.43,12.42 18.87,12.83 18.34,13.26 17.48,13.95 16.87,14.5 v16.36,14.99 15.85,15.44 15.06,16.26 14.5,16.87 14.05,17.37 13.59,17.91 12.9,18.77 12.42,19.43 12.01,20.02 11.63,20.57 11.02,21.51 10.59,22.23 9.93,23.44 9.45,24.43 9.09,25.2 8.81,25.83 8.56,26.47 8.18,27.51 7.9,28.3 7.49,29.62 7.24,30.68 7.04,31.5 v6.78,32.87 6.63,33.96 6.53,34.77 v6.45,35.46 6.4,36.17 6.35,37.26 6.35,38.79 6.38,39.5 6.45,40.59 6.53,41.43 6.6,42.11 6.71,42.8 v6.88,43.89 7.04,44.7 7.19,45.39 7.37,46.05 7.64,47.12 7.9,47.9 8.36,49.23 8.76,50.24 9.09,51 9.37,51.64 9.68,52.27 10.19,53.24 10.59,53.98 10.95,54.56 11.33,55.17 11.94,56.08 12.42,56.77 12.83,57.33 13.26,57.86 13.95,58.73 14.5,59.33 14.99,59.84 15.44,60.35 16.26,61.14 16.87,61.7 17.37,62.15 17.91,62.61 18.77,63.3 19.43,63.78 20.02,64.19 v20.57,64.57 21.51,65.18 22.23,65.61 23.44,66.27 24.43,66.75 25.2,67.11 25.83,67.39 26.47,67.64 27.51,68.02 28.3,68.3 29.62,68.71 30.68,68.96 31.5,69.16 32.87,69.42 v33.96,69.57
  Top 0.152: v33.22,75.13 D059.C | D004.A v54.33,70.64 D005.C | v32.72,2.13 D031.A | v23.8,3.61 D034.C | v2.23,32.11 D043.A | v1.37,44.91 D047.C | v18.03,68.43 D054.A | v72.16,25.38 D018.A | D020.C 70.81,19.21 | v70.92,20.27 D020.C | J406.6 33.1,19.48 30.48,19.48 R2.7 | D020.C
  Bottom 0.152: v52.27,66.52 v54.33,70.64 | v67.84,26.98 v72.16,25.38 | v66.02,22.96 v70.92,20.27 | v32.72,2.13 v33.4,6.71 33.4,17.4 J406.6 | v25.96,8.76 v23.8,3.61 | v6.78,32.87 v2.23,32.11 | v6.88,43.89 v1.37,44.91 | v20.57,64.57 v18.03,68.43 | v33.96,69.57 v33.22,75.13 | v65.94,53.37 70.61,55.93 D110.C | v65.25,21.64 69.8,18.85 D020.C | v40.74,6.45 41.17,1.14 D129.C | v16.36,14.99 12.68,11.07 D137.C | v6.45,35.46 1.14,35.03 D144.C
Q07  (via drill 0.33)
  Top 0.152: v38.79,69.09 39.45,69.06 40.54,68.99 41.35,68.91 42.67,68.76 43.74,68.58 44.55,68.4 45.21,68.28 45.85,68.1 46.89,67.82 47.68,67.56 48.31,67.36 48.95,67.13 49.96,66.73 50.7,66.42 51.31,66.12 51.92,65.84 52.88,65.33 53.59,64.95 v54.76,64.24 55.65,63.63 56.31,63.17 57.38,62.36 58.22,61.67 58.83,61.14 59.33,60.68 60.58,59.44 61.14,58.83 62,57.81 62.69,56.97 63.17,56.31 63.93,55.19 64.52,54.28 64.95,53.59 65.28,53.01 66.06,51.44 66.42,50.7 v66.67,50.09 66.93,49.45 67.31,48.44 67.56,47.68 67.77,47.04 67.97,46.38 68.22,45.34 68.4,44.55 68.56,43.89 68.66,43.2 68.83,42.14 68.91,41.35 68.99,40.66 69.04,39.98 69.09,38.91 69.09,37.41 69.06,36.75 68.99,35.66 68.91,34.85 68.76,33.53 68.58,32.46 68.4,31.65 68.28,30.99 68.1,30.35 67.82,29.31 67.56,28.52 67.36,27.89 67.13,27.25 66.73,26.24 66.42,25.5 66.12,24.89 v65.84,24.28 65.33,23.32 64.95,22.61 64.24,21.44 v63.63,20.55 63.17,19.89 v62.76,19.36 62.36,18.82 61.67,17.98 61.14,17.37 60.68,16.87 59.44,15.62 58.83,15.06 57.81,14.2 56.97,13.51 56.31,13.03 55.19,12.27 54.28,11.68 53.59,11.25 53.01,10.92 51.44,10.13 50.7,9.78 50.09,9.53 49.45,9.27 48.44,8.89 47.68,8.64 47.04,8.43 46.38,8.23 45.34,7.98 44.55,7.8 43.89,7.64 43.2,7.54 42.14,7.37 41.35,7.29 40.66,7.21 39.98,7.16 38.91,7.11 v37.41,7.11 36.75,7.14 35.66,7.21 34.85,7.29 33.53,7.44 32.46,7.62 31.65,7.8 30.99,7.92 v30.35,8.1 29.31,8.38 28.52,8.64 27.89,8.84 27.25,9.07 26.24,9.47 25.5,9.78 24.89,10.08 24.28,10.36 v23.32,10.87 22.61,11.25 21.44,11.96 20.55,12.57 19.89,13.03 18.82,13.84 17.98,14.53 17.37,15.06 16.87,15.52 15.62,16.76 15.06,17.37 v14.63,17.88 14.2,18.39 13.51,19.23 13.03,19.89 12.27,21.01 11.68,21.92 11.25,22.61 10.92,23.19 10.13,24.77 9.78,25.5 9.53,26.11 9.27,26.75 8.89,27.76 8.64,28.52 8.43,29.16 8.23,29.82 7.98,30.86 7.8,31.65 7.64,32.31 7.54,32.99 7.37,34.06 7.29,34.85 7.21,35.53 v7.16,36.22 7.11,37.29 7.11,38.79 7.14,39.45 7.21,40.54 7.29,41.35 7.44,42.67 7.62,43.74 7.8,44.55 7.92,45.21 8.1,45.85 v8.38,46.89 8.64,47.68 8.84,48.31 9.07,48.95 9.47,49.96 9.78,50.7 10.08,51.31 10.36,51.92 10.87,52.88 11.25,53.59 11.96,54.76 12.57,55.65 13.03,56.31 13.84,57.38 14.53,58.22 15.06,58.83 15.52,59.33 16.76,60.58 17.37,61.14 18.39,62 19.23,62.69 19.89,63.17 21.01,63.93 21.92,64.52 22.61,64.95 23.19,65.28 v23.8,65.58
  Top 0.152: D105.A v57.63,68.76 D006.C | v29.01,2.9 D032.A | v20.27,5.28 D035.C | v1.8,35.89 D044.A | v2.29,48.72 D048.C | v21.31,70.36 D055.A | v68.89,16.94 D021.C | v70.64,21.87 D019.A | J406.7 30.86,19.18 30,19.18 30,20.6 R2.6 | D021.C
  Bottom 0.152: v57.63,68.76 v54.76,64.24 53.59,64.95 55.91,68.94 D105.A | v65.84,24.28 v70.64,21.87 | v63.63,20.55 v68.89,16.94 | v29.01,2.9 v30.35,8.1 30.35,16.89 J406.7 | v23.32,10.87 v20.27,5.28 | v7.16,36.22 v1.8,35.89 | v8.38,46.89 v2.29,48.72 | v23.8,65.58 v21.31,70.36 | v38.79,69.09 38.91,75.18 D100.C | v66.67,50.09 72.31,52.45 D111.C | v62.76,19.36 67.61,15.65 D021.C | v37.41,7.11 37.29,1.02 D130.C | v14.63,17.88 10.01,13.89 D138.C
Q08  (via drill 0.33)  (1 unrouted)
  Top 0.152: v41.91,68.07 42.57,68 43.61,67.82 44.37,67.67 45.03,67.51 45.67,67.36 46.69,67.08 47.45,66.85 48.06,66.62 48.69,66.42 49.66,66.02 50.39,65.71 51,65.43 51.59,65.15 52.53,64.67 53.21,64.29 53.77,63.93 54.33,63.6 55.22,63.02 55.85,62.56 v56.92,61.75 57.73,61.09 58.32,60.55 58.8,60.12 59.28,59.66 60.02,58.9 60.55,58.32 61.01,57.84 61.42,57.33 62.08,56.49 62.56,55.85 62.94,55.32 63.3,54.79 63.88,53.9 64.29,53.21 64.59,52.63 64.92,52.05 65.38,51.1 65.71,50.39 66.22,49.17 66.6,48.18 66.85,47.45 v67.06,46.81 67.23,46.18 67.49,45.16 67.67,44.37 67.79,43.74 67.92,43.08 68.07,42.04 68.15,41.25 68.22,40.62 68.28,39.95 68.33,38.89 v68.33,38.1 68.33,37.44 68.3,36.78 68.22,35.74 68.15,34.95 68,33.63 67.82,32.59 67.67,31.83 67.51,31.17 67.36,30.53 67.08,29.52 66.85,28.75 66.62,28.14 66.42,27.51 66.02,26.54 65.71,25.81 65.43,25.2 65.15,24.61 64.67,23.67 64.29,22.99 63.93,22.43 v63.6,21.87 63.02,20.98 62.56,20.34 61.75,19.28 v61.09,18.47 60.55,17.88 v60.12,17.4 59.66,16.92 58.9,16.18 58.32,15.65 57.84,15.19 57.33,14.78 56.49,14.12 55.85,13.64 55.32,13.26 54.79,12.9 53.9,12.32 53.21,11.91 52.63,11.61 52.05,11.28 51.1,10.82 50.39,10.49 49.17,9.98 48.18,9.6 47.45,9.35 46.81,9.14 46.18,8.97 45.16,8.71 44.37,8.53 43.74,8.41 43.08,8.28 42.04,8.13 41.25,8.05 40.62,7.98 39.95,7.92 38.89,7.87 37.44,7.87 36.78,7.9 35.74,7.98 34.95,8.05 v34.29,8.13 33.63,8.2 32.59,8.38 31.83,8.53 31.17,8.69 30.53,8.84 29.52,9.12 28.75,9.35 28.14,9.58 v27.51,9.78 26.54,10.19 25.81,10.49 25.2,10.77 24.61,11.05 23.67,11.53 22.99,11.91 22.43,12.27 21.87,12.6 v20.98,13.18 20.34,13.64 19.28,14.45 18.47,15.11 17.88,15.65 17.4,16.08 16.92,16.54 16.18,17.3 15.65,17.88 15.19,18.36 14.78,18.87 14.12,19.71 13.64,20.34 13.26,20.88 12.9,21.41 12.32,22.3 11.91,22.99 11.61,23.57 11.28,24.16 10.82,25.09 10.49,25.81 9.98,27.03 9.6,28.02 9.35,28.75 9.14,29.39 8.97,30.02 8.71,31.04 8.53,31.83 8.41,32.46 8.28,33.12 8.13,34.16 8.05,34.95 7.98,35.59 7.92,36.25 7.87,37.31 7.87,38.76 v7.9,39.42 7.98,40.46 8.05,41.25 8.2,42.57 8.38,43.61 8.53,44.37 8.69,45.03 8.84,45.67 9.12,46.69 9.35,47.45 9.58,48.06 9.78,48.69 v10.19,49.66 10.49,50.39 10.77,51 11.05,51.59 11.53,52.53 11.91,53.21 12.27,53.77 12.6,54.33 13.18,55.22 13.64,55.85 14.45,56.92 15.11,57.73 15.65,58.32 16.08,58.8 16.54,59.28 17.3,60.02 17.88,60.55 18.36,61.01 18.87,61.42 19.71,62.08 20.34,62.56 20.88,62.94 21.41,63.3 22.3,63.88 22.99,64.29 23.57,64.59 24.16,64.92 25.09,65.38 25.81,65.71 v27.03,66.22
  Top 0.152: v25.38,4.04 D033.A | D036.C v16.94,7.32 | v1.78,39.67 D045.A | v3.61,52.4 D049.C | v24.77,71.93 D056.A | D007.C v60.73,66.55 59.48,67.53 D106.A | v66.5,13.84 D022.C | v68.76,18.57 D020.A | J406.8 29.41,18.29 29.41,20.6 R2.5 | D022.C | D106.A
  Bottom 0.152: v63.6,21.87 v68.76,18.57 | v61.09,18.47 v66.5,13.84 | v25.38,4.04 v27.51,9.78 27.51,12.01 27.94,12.45 27.94,17.02 J406.8 | v16.94,7.32 v20.98,13.18 | v7.9,39.42 v1.78,39.67 | v10.19,49.66 v3.61,52.4 | v27.03,66.22 v24.77,71.93 | v41.91,68.07 42.77,74.91 D101.C | v67.06,46.81 73.61,48.79 D112.C | v60.12,17.4 65.13,12.68 D022.C | v34.29,8.13 33.43,1.29 D131.C | D106.A 59.03,66.9 55.85,62.56 v56.92,61.75 v60.73,66.55 | v68.33,38.1 D115.A
Q09  (via drill 0.33)  (1 unrouted)
  Top 0.152: v44.86,66.78 45.47,66.62 46.46,66.34 47.19,66.12 48.41,65.71 49.38,65.33 50.09,65.02 51.26,64.47 52.17,63.98 52.83,63.63 53.39,63.3 53.92,62.94 54.79,62.38 55.42,61.92 56.44,61.16 57.23,60.5 57.81,59.99 58.29,59.56 v58.75,59.11 59.46,58.37 59.99,57.81 60.43,57.33 60.83,56.84 61.47,56.03 61.92,55.42 62.31,54.89 62.66,54.36 63.22,53.49 63.63,52.83 64.24,51.71 64.69,50.77 65.02,50.09 65.28,49.51 65.51,48.9 65.86,47.93 66.12,47.19 66.32,46.58 66.5,45.97 66.75,44.98 66.93,44.22 v67.06,43.59 67.16,42.95 67.31,41.94 67.41,41.17 67.51,39.9 67.56,38.86 67.56,37.47 67.54,36.8 67.46,35.79 v67.41,35.03 67.33,34.39 67.23,33.76 67.08,32.74 66.93,31.98 66.78,31.34 66.62,30.73 66.34,29.74 66.12,29.01 65.71,27.79 65.33,26.82 65.02,26.11 64.47,24.94 63.98,24.03 63.63,23.37 63.3,22.81 62.94,22.28 62.38,21.41 61.92,20.78 v61.16,19.76 60.5,18.97 59.99,18.39 59.56,17.91 59.11,17.45 v58.37,16.74 57.81,16.2 v57.33,15.77 56.84,15.37 56.03,14.73 v55.42,14.28 54.89,13.89 54.36,13.54 53.49,12.98 52.83,12.57 51.71,11.96 50.77,11.51 50.09,11.18 49.51,10.92 48.9,10.69 47.93,10.34 47.19,10.08 46.58,9.88 45.97,9.7 44.98,9.45 44.22,9.27 43.59,9.14 42.95,9.04 41.94,8.89 41.17,8.79 39.9,8.69 38.86,8.64 37.47,8.64 36.8,8.66 35.79,8.74 35.03,8.79 34.39,8.87 33.76,8.97 32.74,9.12 31.98,9.27 31.34,9.42 30.73,9.58 29.74,9.86 29.01,10.08 27.79,10.49 26.82,10.87 26.11,11.18 v24.94,11.73 24.03,12.22 23.37,12.57 22.81,12.9 22.28,13.26 21.41,13.82 20.78,14.28 19.76,15.04 v18.97,15.7 18.39,16.2 17.91,16.64 17.45,17.09 16.74,17.83 16.2,18.39 15.77,18.87 15.37,19.36 14.73,20.17 14.28,20.78 13.89,21.31 13.54,21.84 12.98,22.71 12.57,23.37 11.96,24.49 11.51,25.43 11.18,26.11 10.92,26.7 10.69,27.3 10.34,28.27 10.08,29.01 9.88,29.62 9.7,30.23 9.45,31.22 9.27,31.98 9.14,32.61 9.04,33.25 8.89,34.27 8.79,35.03 8.69,36.3 8.64,37.34 8.64,38.73 8.66,39.4 8.74,40.41 8.79,41.17 8.87,41.81 v8.97,42.44 9.12,43.46 9.27,44.22 9.42,44.86 9.58,45.47 9.86,46.46 10.08,47.19 10.49,48.41 10.87,49.38 11.18,50.09 11.73,51.26 v12.22,52.17 12.57,52.83 12.9,53.39 13.26,53.92 13.82,54.79 14.28,55.42 15.04,56.44 15.7,57.23 16.2,57.81 16.64,58.29 17.09,58.75 17.83,59.46 18.39,59.99 18.87,60.43 19.36,60.83 20.17,61.47 20.78,61.92 21.31,62.31 21.84,62.66 22.71,63.22 23.37,63.63 24.49,64.24 25.43,64.69 26.11,65.02 26.7,65.28 27.3,65.51 28.27,65.86 29.01,66.12 29.62,66.32 v30.23,66.5
  Top 0.152: v21.87,5.56 D034.A | D037.C v13.84,9.7 | v2.13,43.48 D046.A | v5.28,55.93 D050.C | v28.4,73.13 D057.A | D008.C v63.58,64.03 62.45,65.14 D107.A | v63.8,11.02 D023.C | v66.55,15.47 D021.A | J405.1 28.93,57.91 28.93,55.09 R3.8 | D023.C | D107.A
  Bottom 0.152: v61.16,19.76 v66.55,15.47 | v58.37,16.74 v63.8,11.02 | v24.94,11.73 v21.87,5.56 | v13.84,9.7 v18.97,15.7 | v8.97,42.44 v2.13,43.48 | v12.22,52.17 v5.28,55.93 | v28.4,73.13 v30.23,66.5 31.24,65.48 31.24,59.94 J405.1 | v44.86,66.78 46.61,74.19 D102.C | v67.06,43.59 74.55,45.01 D113.C | v67.41,35.03 73.51,34.39 D116.A | v57.33,15.77 62.31,10.01 D023.C | v55.42,14.28 59.03,9.3 D124.A | D107.A 61.92,64.54 57.81,59.99 v58.75,59.11 v63.58,64.03
Q10  (via drill 0.33)  (2 unrouted)